# EAGLE design LaserXSegment (EAGLE 9.1.1)
DATE: LAST_DATE_TIME; REV: 2; TITLE: Neo7Segment
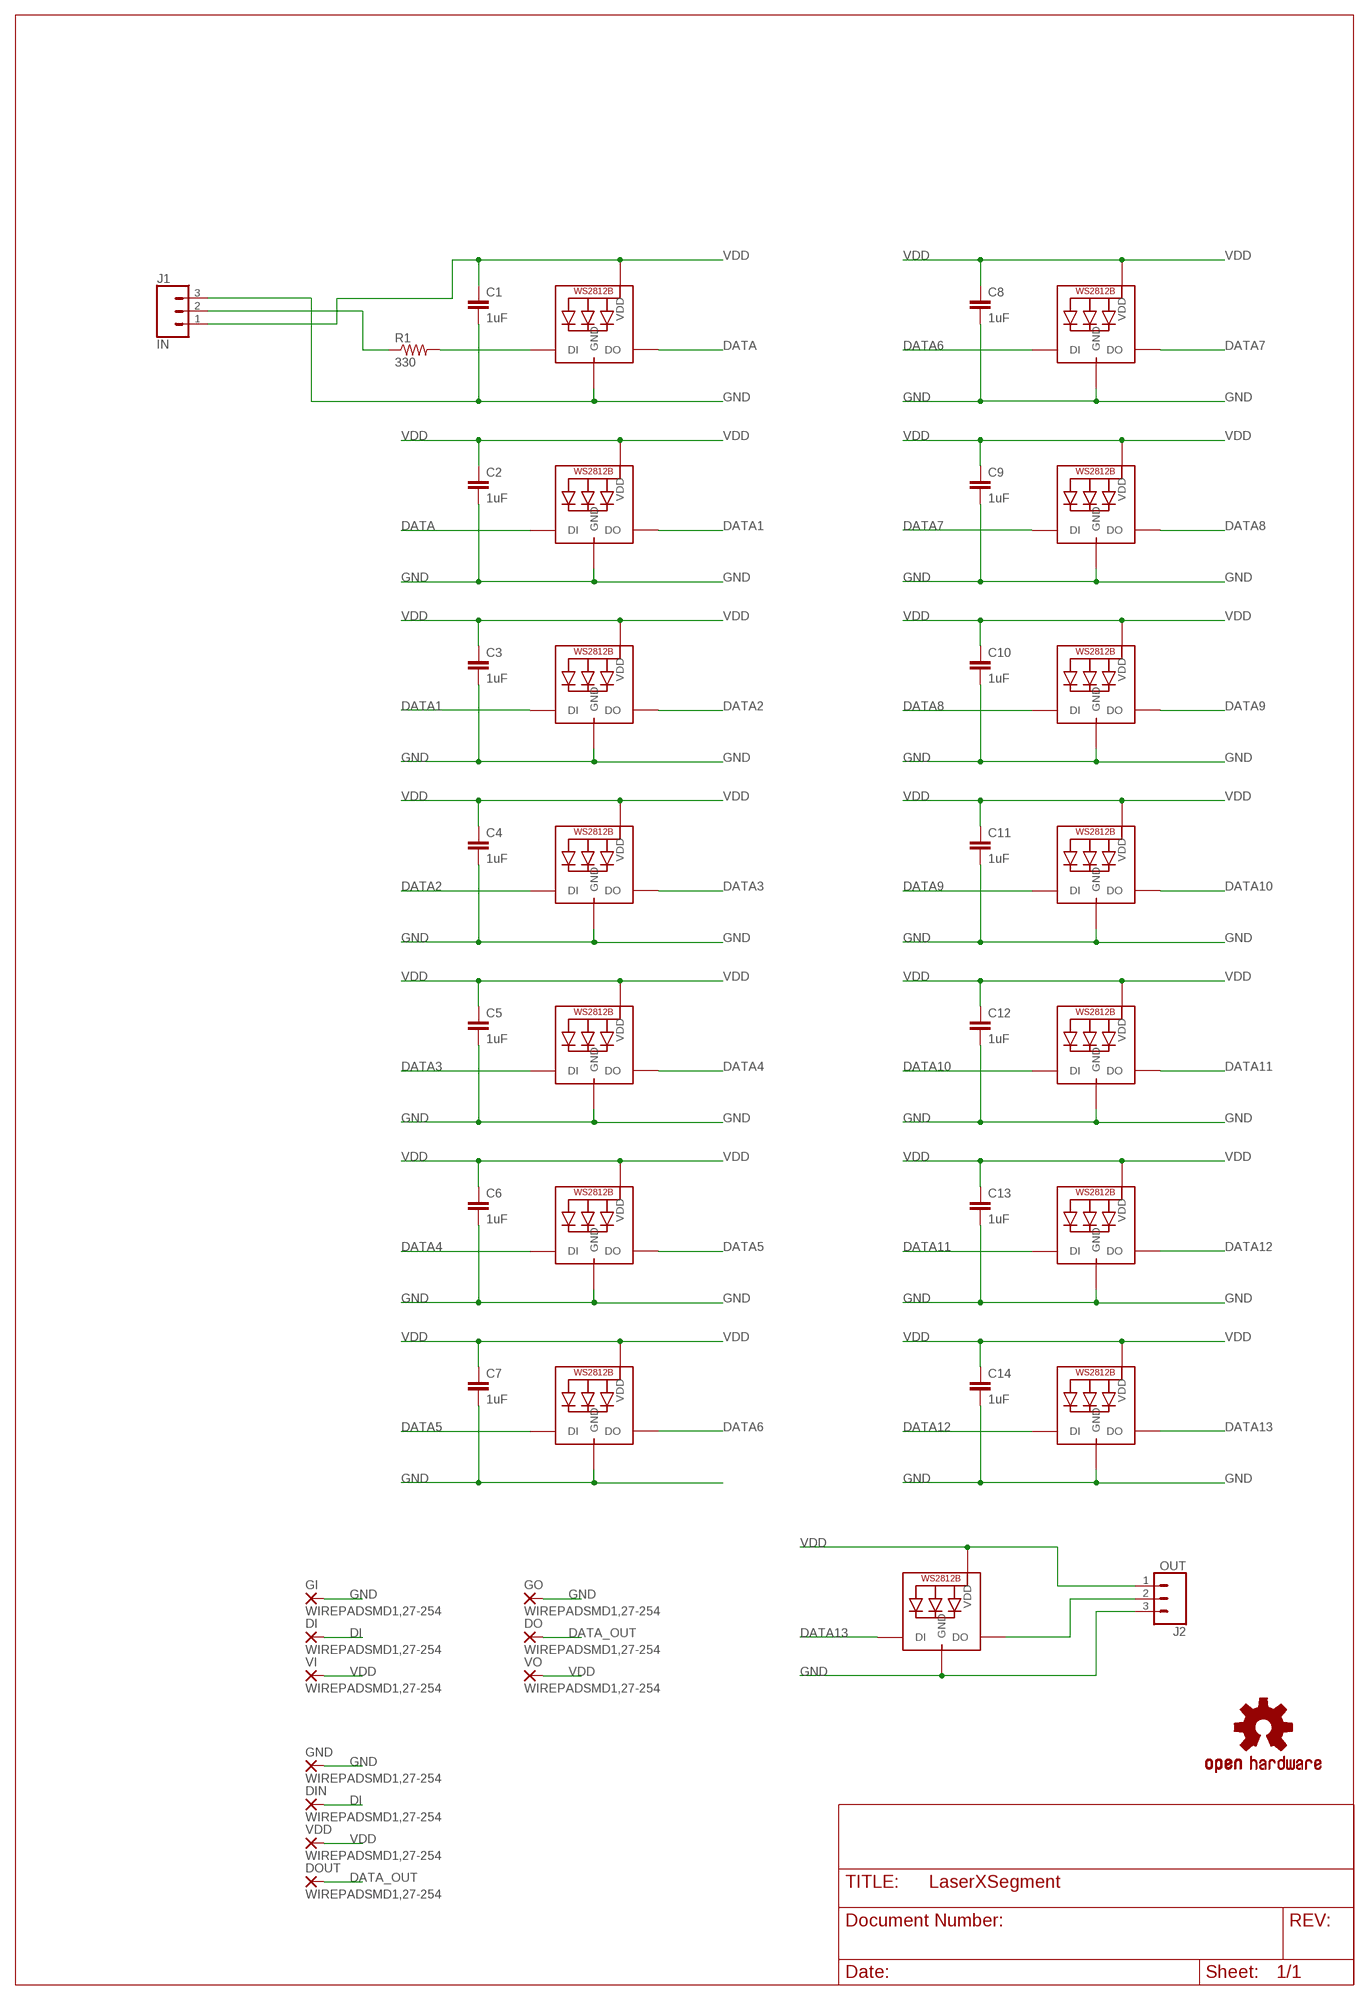
[diagram p0: schematic, sheet 1]

## Parts
C1  1uF  C-EUC0805  [C0805]
C2  1uF  C-EUC0805  [C0805]
C3  1uF  C-EUC0805  [C0805]
C4  1uF  C-EUC0805  [C0805]
C5  1uF  C-EUC0805  [C0805]
C6  1uF  C-EUC0805  [C0805]
C7  1uF  C-EUC0805  [C0805]
C8  1uF  C-EUC0805  [C0805]
C9  1uF  C-EUC0805  [C0805]
C10  1uF  C-EUC0805  [C0805]
C11  1uF  C-EUC0805  [C0805]
C12  1uF  C-EUC0805  [C0805]
C13  1uF  C-EUC0805  [C0805]
C14  1uF  C-EUC0805  [C0805]
DI  WIREPADSMD1,27-254  [SMD1,27-2,54]
DIN  WIREPADSMD1,27-254  [SMD1,27-2,54]
DO  WIREPADSMD1,27-254  [SMD1,27-2,54]
DOUT  WIREPADSMD1,27-254  [SMD1,27-2,54]
GI  WIREPADSMD1,27-254  [SMD1,27-2,54]
GND  WIREPADSMD1,27-254  [SMD1,27-2,54]
GO  WIREPADSMD1,27-254  [SMD1,27-2,54]
J1  IN  CONN_03LONGPADS  [1X03_LONGPADS]
J2  OUT  CONN_03LONGPADS  [1X03_LONGPADS]
L1  WS2812B5050  [WS2812B]
L2  WS2812B5050  [WS2812B]
L3  WS2812B5050  [WS2812B]
L4  WS2812B5050  [WS2812B]
L5  WS2812B5050  [WS2812B]
L6  WS2812B5050  [WS2812B]
L7  WS2812B5050  [WS2812B]
L8  WS2812B5050  [WS2812B]
L9  WS2812B5050  [WS2812B]
L10  WS2812B5050  [WS2812B]
L11  WS2812B5050  [WS2812B]
L12  WS2812B5050  [WS2812B]
L13  WS2812B5050  [WS2812B]
L14  WS2812B5050  [WS2812B]
L15  RGB 3535  WS2812B3535  [LED3535]
LOGO1  OSHW-LOGOM  [OSHW-LOGO-M]
R1  330  R-US_R0805  [R0805]
VDD  WIREPADSMD1,27-254  [SMD1,27-2,54]
VI  WIREPADSMD1,27-254  [SMD1,27-2,54]
VO  WIREPADSMD1,27-254  [SMD1,27-2,54]

## Nets
DATA: L1.2-DOUT(DO) L2.4-DIN(DI)
DATA1: L2.2-DOUT(DO) L3.4-DIN(DI)
DATA2: L3.2-DOUT(DO) L4.4-DIN(DI)
DATA3: L4.2-DOUT(DO) L5.4-DIN(DI)
DATA4: L5.2-DOUT(DO) L6.4-DIN(DI)
DATA5: L6.2-DOUT(DO) L7.4-DIN(DI)
DATA6: L7.2-DOUT(DO) L8.4-DIN(DI)
DATA7: L8.2-DOUT(DO) L9.4-DIN(DI)
DATA8: L9.2-DOUT(DO) L10.4-DIN(DI)
DATA9: L10.2-DOUT(DO) L11.4-DIN(DI)
DATA10: L11.2-DOUT(DO) L12.4-DIN(DI)
DATA11: L12.2-DOUT(DO) L13.4-DIN(DI)
DATA12: L13.2-DOUT(DO) L14.4-DIN(DI)
DATA13: L14.2-DOUT(DO) L15.1(DI)
DATA_OUT: DO.1(P) DOUT.1(P) J2.2 L15.3(DO)
DI: DI.1(P) DIN.1(P) J1.2 R1.1
DI_R: L1.4-DIN(DI) R1.2
GND: C1.2 C2.2 C3.2 C4.2 C5.2 C6.2 C7.2 C8.2 C9.2 C10.2 C11.2 C12.2 C13.2 C14.2 GI.1(P) GND.1(P) GO.1(P) J1.3 J2.3 L1.3-GND(GND) L2.3-GND(GND) L3.3-GND(GND) L4.3-GND(GND) L5.3-GND(GND) L6.3-GND(GND) L7.3-GND(GND) L8.3-GND(GND) L9.3-GND(GND) L10.3-GND(GND) L11.3-GND(GND) L12.3-GND(GND) L13.3-GND(GND) L14.3-GND(GND) L15.4(GND)
VDD: C1.1 C2.1 C3.1 C4.1 C5.1 C6.1 C7.1 C8.1 C9.1 C10.1 C11.1 C12.1 C13.1 C14.1 J1.1 J2.1 L1.1-VDD(VDD) L2.1-VDD(VDD) L3.1-VDD(VDD) L4.1-VDD(VDD) L5.1-VDD(VDD) L6.1-VDD(VDD) L7.1-VDD(VDD) L8.1-VDD(VDD) L9.1-VDD(VDD) L10.1-VDD(VDD) L11.1-VDD(VDD) L12.1-VDD(VDD) L13.1-VDD(VDD) L14.1-VDD(VDD) L15.2(VDD) VDD.1(P) VI.1(P) VO.1(P)

## Library data of the parts
C1-C14 = rcl:C-EU: CAPACITOR, European symbol
DI DIN DO DOUT GI GND GO VDD VI VO = wirepad:WIREPAD: Wire PAD connect wire on PCB
J1 J2 = SparkFun-Connectors:CONN_03: Multi connection point. Often used as Generic Header-pin footprint for 0.1 inch spaced/style header connections On any of the 0.1 inch spaced packages, you can populate with these: Break Away Headers - Straight <https://www.sparkfun.com/products/116> (PRT-00116) Break Away Male Headers - Right Angle <https://www.sparkfun.com/products/553> (PRT-00553) Female Headers <https://www.sparkfun.com/products/115> (PRT-00115) Break Away Headers - Machine Pin <https://www.sparkfun.com/products/117> (PRT-00117) Break Away Female Headers - Swiss Machine Pin <https://www.sparkfun.com/products/743> (PRT-00743) Stackable Header - 3 Pin (Female, 0.1") <https://www.sparkfun.com/products/13875> (PRT-13875) For SCREWTERMINALS and SPRING TERMINALS visit here: Screw Terimnals on SparkFun.com <https://www.sparkfun.com/search/results?term=Screw+Terminals> (5mm/3.5mm/2.54mm spacing) This device is also useful as a general connection point to wire up your design to another part of your project. Our various solder wires solder well into these plated through hole pads. Hook-Up Wire - Assortment (Stranded, 22 AWG) <https://www.sparkfun.com/products/11375> (PRT-11375) Hook-Up Wire - Assortment (Solid Core, 22 AWG) <https://www.sparkfun.com/products/11367> (PRT-11367) View the entire wire category on our website here <https://www.sparkfun.com/categories/141> Special notes: Molex polarized connector foot print use with SKU : PRT-08232 with associated crimp pins and housings.
L1-L15 = adafruit:WS2812B
LOGO1 = SparkFun-Aesthetics:OSHW-LOGO: Open-Source Hardware (OSHW) Logo This logo indicates the piece of hardware it is found on incorporates a OSHW license and/or adheres to the definition of open source hardware found here: http://freedomdefined.org/OSHW
R1 = rcl:R-US_: RESISTOR, American symbol; SPICEPREFIX: R

## Net classes
0 default: width 0.203 mm, drill 0.483 mm, clearance 0.102 mm

## Board
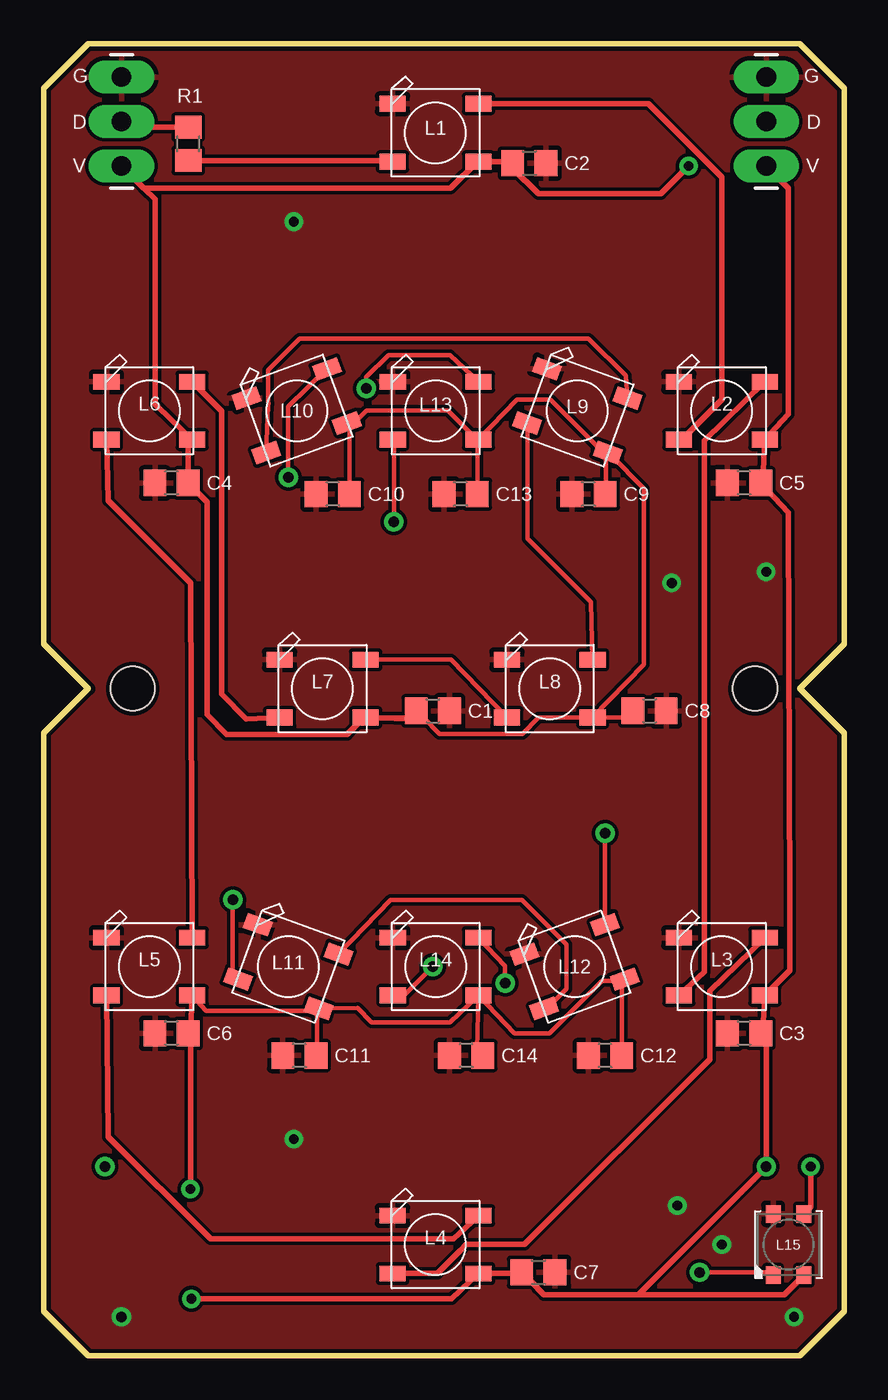
[diagram p1: board, top side]
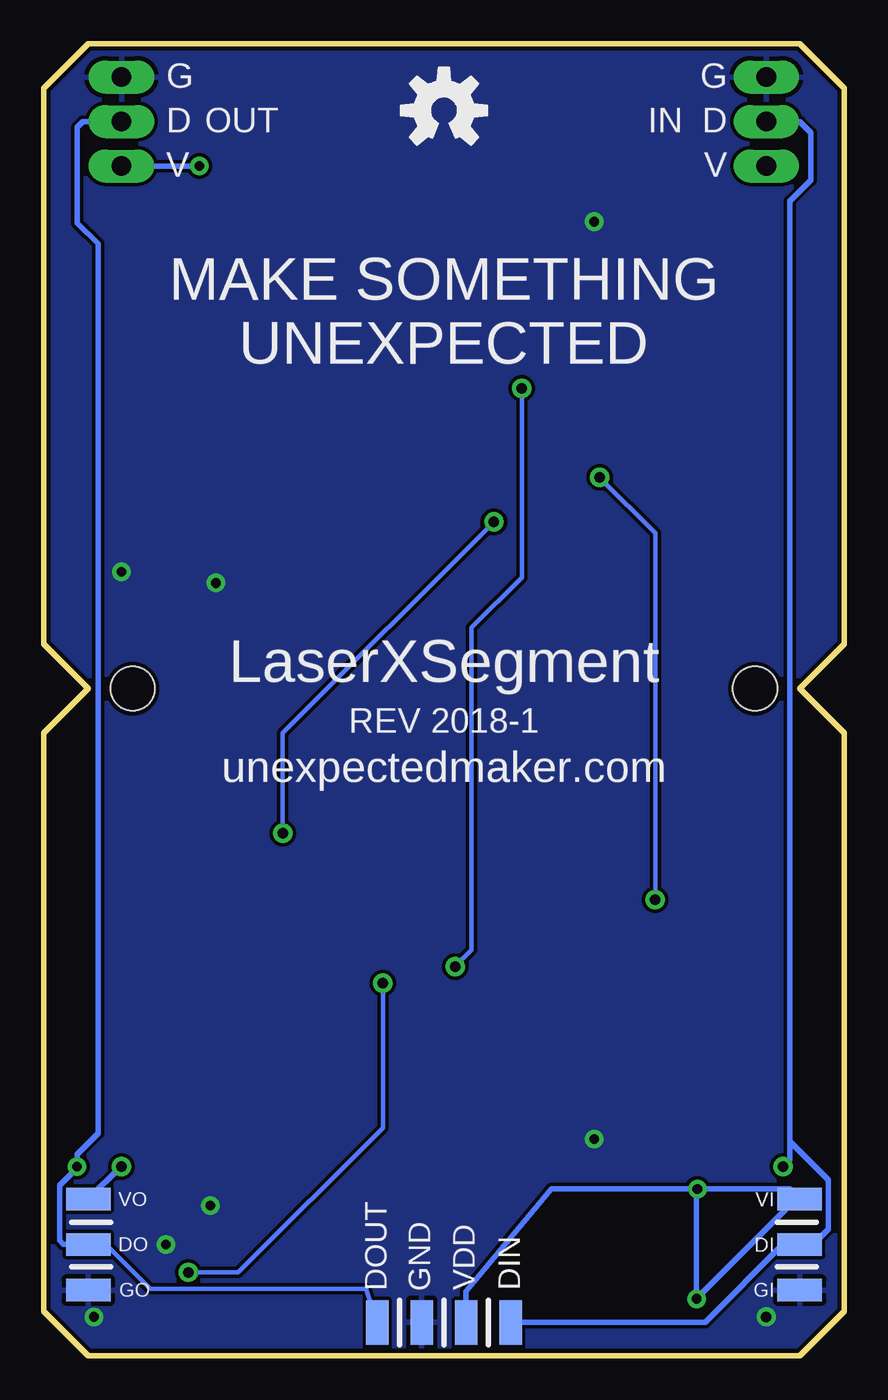
[diagram p2: board, bottom side, seen from below]

Size 45.72 x 74.93 mm. Coordinates in mm from the lower left corner, seen from the top.
Outline: 0,72.39 0,40.64 2.54,38.1 0,35.56 0,2.54 2.54,0 43.18,0 45.72,2.54 45.72,35.56 43.18,38.1 45.72,40.64 45.72,72.39 43.18,74.93 2.54,74.93 0,72.39
Copper layers (1*16): Top 0.035mm / dielectric 1.5mm / Bottom 0.035mm
Design rules "SparkFun": minimum track width 8mil, minimum drill 20mil, track to track 8mil, track to pad 8mil, pad to pad 8mil, via to via 8mil, smd to smd 8mil, copper to edge 10mil, drill to drill 8mil, minimum pad ring 12mil, minimum via ring 10mil, stop-mask expansion 4mil, vias tented up to drill 25mil, thermal gap 10mil
Holes 2.54 mm at 5.08,38.1 40.64,38.1

### Footprints (pad centres in the part's own frame; a part is rotated, then mirrored left to right if it is on the bottom)
C0805 = smd 1.3 x 1.5: 1 -0.95,0; 2 0.95,0
SMD1,27-2,54 = smd 1.27 x 2.54: 1 0,0
1X03_LONGPADS = drill 1.118 pad 1.88 long: 1 0,0; 2 2.54,0; 3 5.08,0
WS2812B = smd 1.5 x 0.9: 1-VDD 2.45,-1.65; 2-DOUT 2.45,1.65; 3-GND -2.45,1.65; 4-DIN -2.45,-1.65
LED3535 = smd 1 x 0.85: 1 -1.75,0.875; 2 -1.75,-0.875; 3 1.75,-0.875; 4 1.75,0.875
R0805 = smd 1.3 x 1.5: 1 -0.95,0; 2 0.95,0

### Placement (x,y rotation side)
C1  22.23,36.83 0 top
C2  27.74,68.11 0 top
C3  40.01,18.41 180 top
C4  7.3,49.85 180 top
C5  40.01,49.85 180 top
C6  7.3,18.41 180 top
C7  28.26,4.76 0 top
C8  34.61,36.83 0 top
C9  31.12,49.21 180 top
C10  16.51,49.21 180 top
C11  14.6,17.15 180 top
C12  32.07,17.15 180 top
C13  23.81,49.21 180 top
C14  24.13,17.15 180 top
DI  2.54,6.35 270 bottom
DIN  19.05,1.91 0 bottom
DO  43.18,6.35 270 bottom
DOUT  26.67,1.91 0 bottom
GI  2.54,3.75 270 bottom
GND  24.13,1.91 0 bottom
GO  43.18,3.75 270 bottom
J1  4.45,67.95 90 top
J2  41.27,67.95 90 top
L1  22.38,69.85 0 top
L2  38.73,53.98 0 top
L3  38.73,22.23 0 top
L4  22.38,6.35 0 top
L5  6.03,22.23 0 top
L6  6.03,53.98 0 top
L7  15.93,38.1 0 top
L8  28.91,38.1 0 top
L9  30.48,53.98 340 top
L10  14.45,53.98 20 top
L11  13.97,22.23 340 top
L12  30.32,22.23 20 top
L13  22.38,53.98 0 top
L14  22.38,22.23 0 top
L15  42.55,6.35 90 top
LOGO1  22.86,71.12 0 bottom
R1  8.26,69.22 270 top
VDD  21.59,1.91 0 bottom
VI  2.54,8.95 270 bottom
VO  43.18,8.95 270 bottom

### Tracks (layer width: path | path; a pad name or v marks a point on that pad's centre or on a via)
DATA
  Top 0.305: L2.4-DIN 36.45,52.33 38.73,54.61 38.73,67.31 34.55,71.5 L1.2-DOUT
DATA1
  Top 0.305: L2.2-DOUT 37.73,52.27 37.73,21.92 L3.4-DIN
DATA2
  Top 0.305: L4.4-DIN 22.48,4.7 23.81,6.03 24.13,6.35 27.46,6.35 38.05,16.94 38.05,20.84 L3.2-DOUT
DATA3
  Top 0.305: L4.2-DOUT 23.4,6.67 9.53,6.67 3.68,12.51 L5.4-DIN
DATA4
  Top 0.305: L5.2-DOUT 8.38,44.13 3.68,48.83 L6.4-DIN
DATA5
  Top 0.305: L6.2-DOUT 10.16,53.95 10.16,43.18 10.16,37.78 11.57,36.37 L7.4-DIN
DATA6
  Top 0.254: L7.2-DOUT 23.26,39.75 L8.4-DIN
DATA7
  Top 0.254: L8.2-DOUT 31.26,43.04 27.62,46.67 27.62,53.14 L9.4-DIN
DATA8
  Top 0.254: L9.2-DOUT 33.25,55.97 31.12,58.1 14.6,58.1 12.8,56.3 12.8,54.49 12.85,54.36 12.8,54.27 L10.4-DIN
DATA9  (via drill 0.6)
  Top 0.254: L10.2-DOUT 13.97,54.21 13.97,51.28 13.97,51.26 13.97,51.25 v13.97,50.17 | v10.79,26.04 10.79,21.88 L11.4-DIN
  Bottom 0.254: v13.97,50.17 10.79,46.99 v10.79,26.04
DATA10
  Top 0.254: L11.2-DOUT 19.81,26.04 27.3,26.04 29.84,23.5 29.84,20.95 28.76,19.87 L12.4-DIN
DATA11  (via drill 0.6)
  Top 0.254: v20,47.62 20,52.29 L13.4-DIN | L12.2-DOUT v32.06,29.84 v32.07,29.84
  Bottom 0.254: v20,47.62 32.07,35.56 v32.07,29.84
DATA12  (via drill 0.6)
  Top 0.254: v22.23,22.23 20.58,20.58 L14.4-DIN | L13.2-DOUT 23.21,57.15 19.69,57.15 18.41,55.88 v18.41,55.25
  Bottom 0.254: v22.23,22.23 21.27,23.18 21.27,41.59 18.41,44.45 v18.41,55.25
DATA13  (via drill 0.6)
  Top 0.254: L14.2-DOUT 26.35,22.26 v26.35,21.27 | v37.47,4.76 41.51,4.76 L15.1
  Bottom 0.254: v37.47,4.76 34.61,4.76 26.35,13.02 v26.35,21.27
DATA_OUT  (via drill 0.55)
  Top 0.305: v43.82,10.8 43.82,8.5 L15.3
  Bottom 0.254: DO.1 42.17,6.35 39.65,3.83 27.32,3.83 DOUT.1
  Bottom 0.305: J2.2 43.5,70.48 43.82,70.17 43.82,64.69 42.62,63.5 42.62,12.7 43.82,11.51 v43.82,10.8 43.82,10.73 44.81,9.74 44.81,6.58 44.6,6.38 43.2,6.38 DO.1
DI  (via drill 0.6)
  Top 0.305: R1.1 4.77,70.17 J1.2
  Bottom 0.305: J1.2 2.54,70.48 1.91,69.85 1.91,67.15 3.1,65.95 3.1,12.24 | 3.1,12.24 0.91,10.05 0.91,7.22 1.37,6.77 2.12,6.77 DI.1 3.49,6.35 7.94,1.91 8.89,1.91 DIN.1 | 3.1,12.24 3.1,11.19 v3.49,10.8
DI_R
  Top 0.305: L1.4-DIN 19.96,68.27 R1.2
GND  (via drill 0.55, 0.6)
  other vias: 14.29,12.38 36.2,8.57 4.45,2.22 42.86,2.22 14.29,64.77 38.73,6.35 35.88,44.13 41.27,44.77
  pour Top: -2.54,77.47 -2.54,-2.54 48.9,-2.54 48.9,77.47
  pour Bottom: -3.81,78.74 49.85,78.74 49.85,-5.08 -3.81,-5.08
VDD  (via drill 0.55, 0.6)
  Top 0.254: L7.1-VDD 21.69,36.45 22.62,35.52 27.34,35.52 28.27,36.45 L8.1-VDD | L8.1-VDD 33.28,36.45 C8.1 | C10.1 17.46,52.99 | 17.46,52.99 L10.1-VDD | C13.1 24.76,52.3 | 24.76,52.3 L13.1-VDD 27.02,54.61 28.95,54.61 32.12,51.44 | C9.1 32.12,49.27 32.12,51.44 | 32.12,51.44 L9.1-VDD | 15.61,19.69 L11.1-VDD 17.91,19.87 18.73,19.05 23.21,19.05 L14.1-VDD | 15.61,19.69 15.61,17.2 C11.1 | L14.1-VDD 24.73,17.49 C14.1 | C12.1 33.02,21.4 | 33.02,21.4 L12.1-VDD | L5.1-VDD 9.27,19.69 15.61,19.69 | L14.1-VDD 26.89,18.41 28.89,18.41 31.88,21.4 33.02,21.4 | 17.46,52.99 18.45,53.98 23.08,53.98 24.76,52.3 | L8.1-VDD 34.29,39.48 34.29,49.53 32.39,51.44 32.12,51.44
  Top 0.305: J1.1 5.71,66.67 | 5.71,66.67 6.35,66.04 6.35,65.72 6.35,54.36 | L15.2 42.31,3.49 34.29,3.49 33.97,3.49 | 5.71,66.67 23.24,66.67 24.77,68.2 L1.1-VDD 26.7,68.2 C2.1 26.79,67.83 28.26,66.36 35.24,66.36 v36.83,67.95 | L5.1-VDD 8.38,18.55 C6.1 8.38,18.29 v8.38,9.52 | 33.97,3.49 v41.27,10.8 41.27,18.09 C3.1 41.09,18.55 L3.1-VDD 42.63,22.02 42.63,25.72 42.55,48.17 C5.1 41.09,49.98 L2.1-VDD 42.55,53.78 42.55,66.67 J2.1 | 33.97,3.49 28.58,3.49 28.2,3.87 C7.1 27.25,4.7 L4.1-VDD 23.28,3.25 v8.43,3.25 | C1.1 20.82,36.37 L7.1-VDD 18.21,36.37 17.33,35.49 10.46,35.49 9.33,36.62 9.33,48.77 C4.1 8.25,52.2 L6.1-VDD 6.54,54.17 | 6.35,54.36 6.54,54.17 | 6.35,54.36 6.54,54.17
  Bottom 0.305: v8.38,9.52 8.43,9.48 v8.43,3.25 2.73,8.95 VI.1 3.11,9.52 v8.38,9.52 | v36.83,67.95 J2.1 | VO.1 41.34,10.8 v41.27,10.8 | v8.38,9.52 16.72,9.52 21.59,3.68 VDD.1

### Text on the board
tPlace: G | G | D | D | V | V
bPlace: G | G | D | IN | OUT | D | V | V | MAKE SOMETHING / UNEXPECTED | LaserXSegment | REV 2018-1 | unexpectedmaker.com